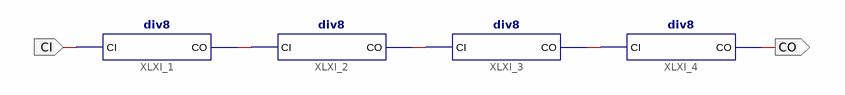
[diagram p0: schematic sheet 1]
// Xilinx ISE schematic div24.sch (spartan6) as structural Verilog: 4 symbols, 2 ports
module div24 (
  input  CI,
  output CO
);

  wire XLXN_1, XLXN_2, XLXN_3;

  div8 XLXI_1 (.CI(CI), .CO(XLXN_1));
  div8 XLXI_2 (.CI(XLXN_1), .CO(XLXN_2));
  div8 XLXI_3 (.CI(XLXN_2), .CO(XLXN_3));
  div8 XLXI_4 (.CI(XLXN_3), .CO(CO));
endmodule
